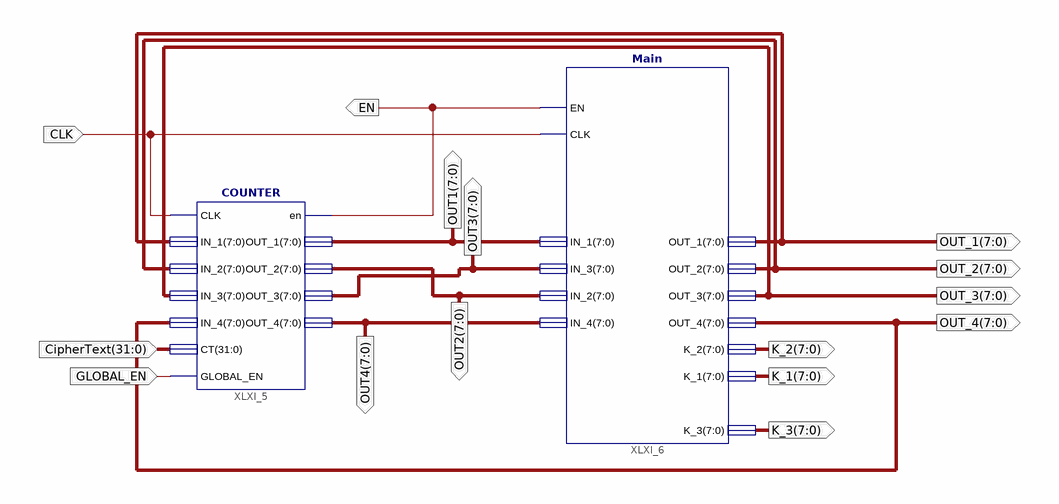
[diagram p0: schematic sheet 1]
// Xilinx ISE schematic Rough_S_LUT.sch (spartan6) as structural Verilog: 2 symbols, 15 ports
module Rough_S_LUT (
  input  CLK,
  input  [31:0] CipherText,
  input  GLOBAL_EN,
  output [7:0] OUT1,
  output [7:0] OUT2,
  output [7:0] OUT3,
  output [7:0] OUT4,
  output [7:0] OUT_1,
  output [7:0] OUT_2,
  output [7:0] OUT_3,
  output [7:0] OUT_4,
  output [7:0] K_2,
  output [7:0] K_1,
  output [7:0] K_3,
  output EN
);

  Main XLXI_6 (
    .IN_1(OUT1), .EN(EN), .CLK(CLK), .IN_3(OUT3), .IN_2(OUT2), .IN_4(OUT4), .OUT_1(OUT_1), .OUT_2(OUT_2),
    .OUT_3(OUT_3), .OUT_4(OUT_4), .K_3(K_3), .K_2(K_2), .K_1(K_1));
  COUNTER XLXI_5 (
    .CLK(CLK), .GLOBAL_EN(GLOBAL_EN), .IN_1(OUT_1), .IN_2(OUT_2), .IN_3(OUT_3), .IN_4(OUT_4),
    .CT(CipherText), .en(EN), .OUT_1(OUT1), .OUT_2(OUT2), .OUT_3(OUT3), .OUT_4(OUT4));
endmodule
